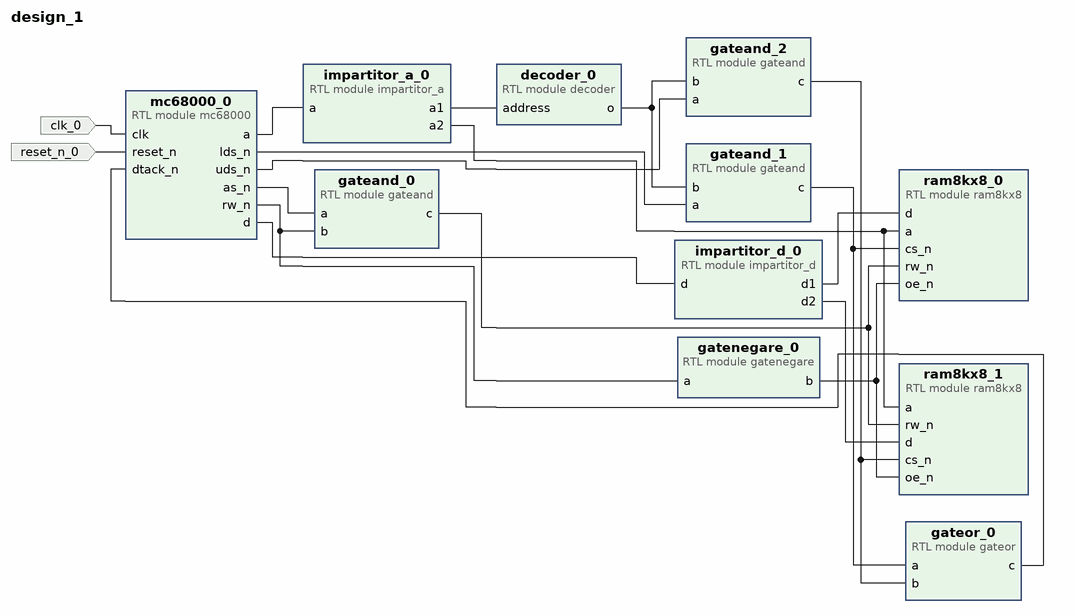
[diagram p0: block diagram of the top level]
# Vivado block design design_1, xc7a100tcsg324-1, Vivado 2019.1
create_bd_design design_1

create_bd_port -dir I -type clk clk_0
create_bd_port -dir I -type rst reset_n_0

create_bd_cell -type module -reference gateand gateand_0
create_bd_cell -type module -reference gateor gateor_0
create_bd_cell -type module -reference gatenegare gatenegare_0
create_bd_cell -type module -reference gateand gateand_1
create_bd_cell -type module -reference gateand gateand_2
create_bd_cell -type module -reference impartitor_d impartitor_d_0
create_bd_cell -type module -reference impartitor_a impartitor_a_0
create_bd_cell -type module -reference mc68000 mc68000_0
create_bd_cell -type module -reference ram8kx8 ram8kx8_0
create_bd_cell -type module -reference ram8kx8 ram8kx8_1
create_bd_cell -type module -reference decoder decoder_0

# ---- connections ----

connect_bd_net -net clk_0_1 [get_bd_ports clk_0] [get_bd_pins mc68000_0/clk]
connect_bd_net -net reset_n_0_1 [get_bd_ports reset_n_0] [get_bd_pins mc68000_0/reset_n]
connect_bd_net [get_bd_pins mc68000_0/a] [get_bd_pins impartitor_a_0/a]
connect_bd_net [get_bd_pins mc68000_0/d] [get_bd_pins impartitor_d_0/d]
connect_bd_net [get_bd_pins impartitor_d_0/d2] [get_bd_pins ram8kx8_1/d]
connect_bd_net [get_bd_pins impartitor_d_0/d1] [get_bd_pins ram8kx8_0/d]
connect_bd_net [get_bd_pins impartitor_a_0/a1] [get_bd_pins decoder_0/address]
connect_bd_net [get_bd_pins decoder_0/o] [get_bd_pins gateand_1/b] [get_bd_pins gateand_2/b]
connect_bd_net [get_bd_pins mc68000_0/as_n] [get_bd_pins gateand_0/a]
connect_bd_net [get_bd_pins mc68000_0/rw_n] [get_bd_pins gateand_0/b] [get_bd_pins gatenegare_0/a]
connect_bd_net [get_bd_pins gateand_0/c] [get_bd_pins ram8kx8_0/rw_n] [get_bd_pins ram8kx8_1/rw_n]
connect_bd_net [get_bd_pins gatenegare_0/b] [get_bd_pins ram8kx8_0/oe_n] [get_bd_pins ram8kx8_1/oe_n]
connect_bd_net [get_bd_pins mc68000_0/uds_n] [get_bd_pins gateand_2/a]
connect_bd_net [get_bd_pins mc68000_0/lds_n] [get_bd_pins gateand_1/a]
connect_bd_net [get_bd_pins impartitor_a_0/a2] [get_bd_pins ram8kx8_1/a] [get_bd_pins ram8kx8_0/a]
connect_bd_net [get_bd_pins gateor_0/c] [get_bd_pins mc68000_0/dtack_n]
connect_bd_net [get_bd_pins gateand_1/c] [get_bd_pins ram8kx8_0/cs_n] [get_bd_pins gateor_0/a]
connect_bd_net [get_bd_pins gateand_2/c] [get_bd_pins ram8kx8_1/cs_n] [get_bd_pins gateor_0/b]

validate_bd_design
save_bd_design
